# EAGLE design Logomatic (EAGLE 7.4.0)

## Sheet 1 of 2
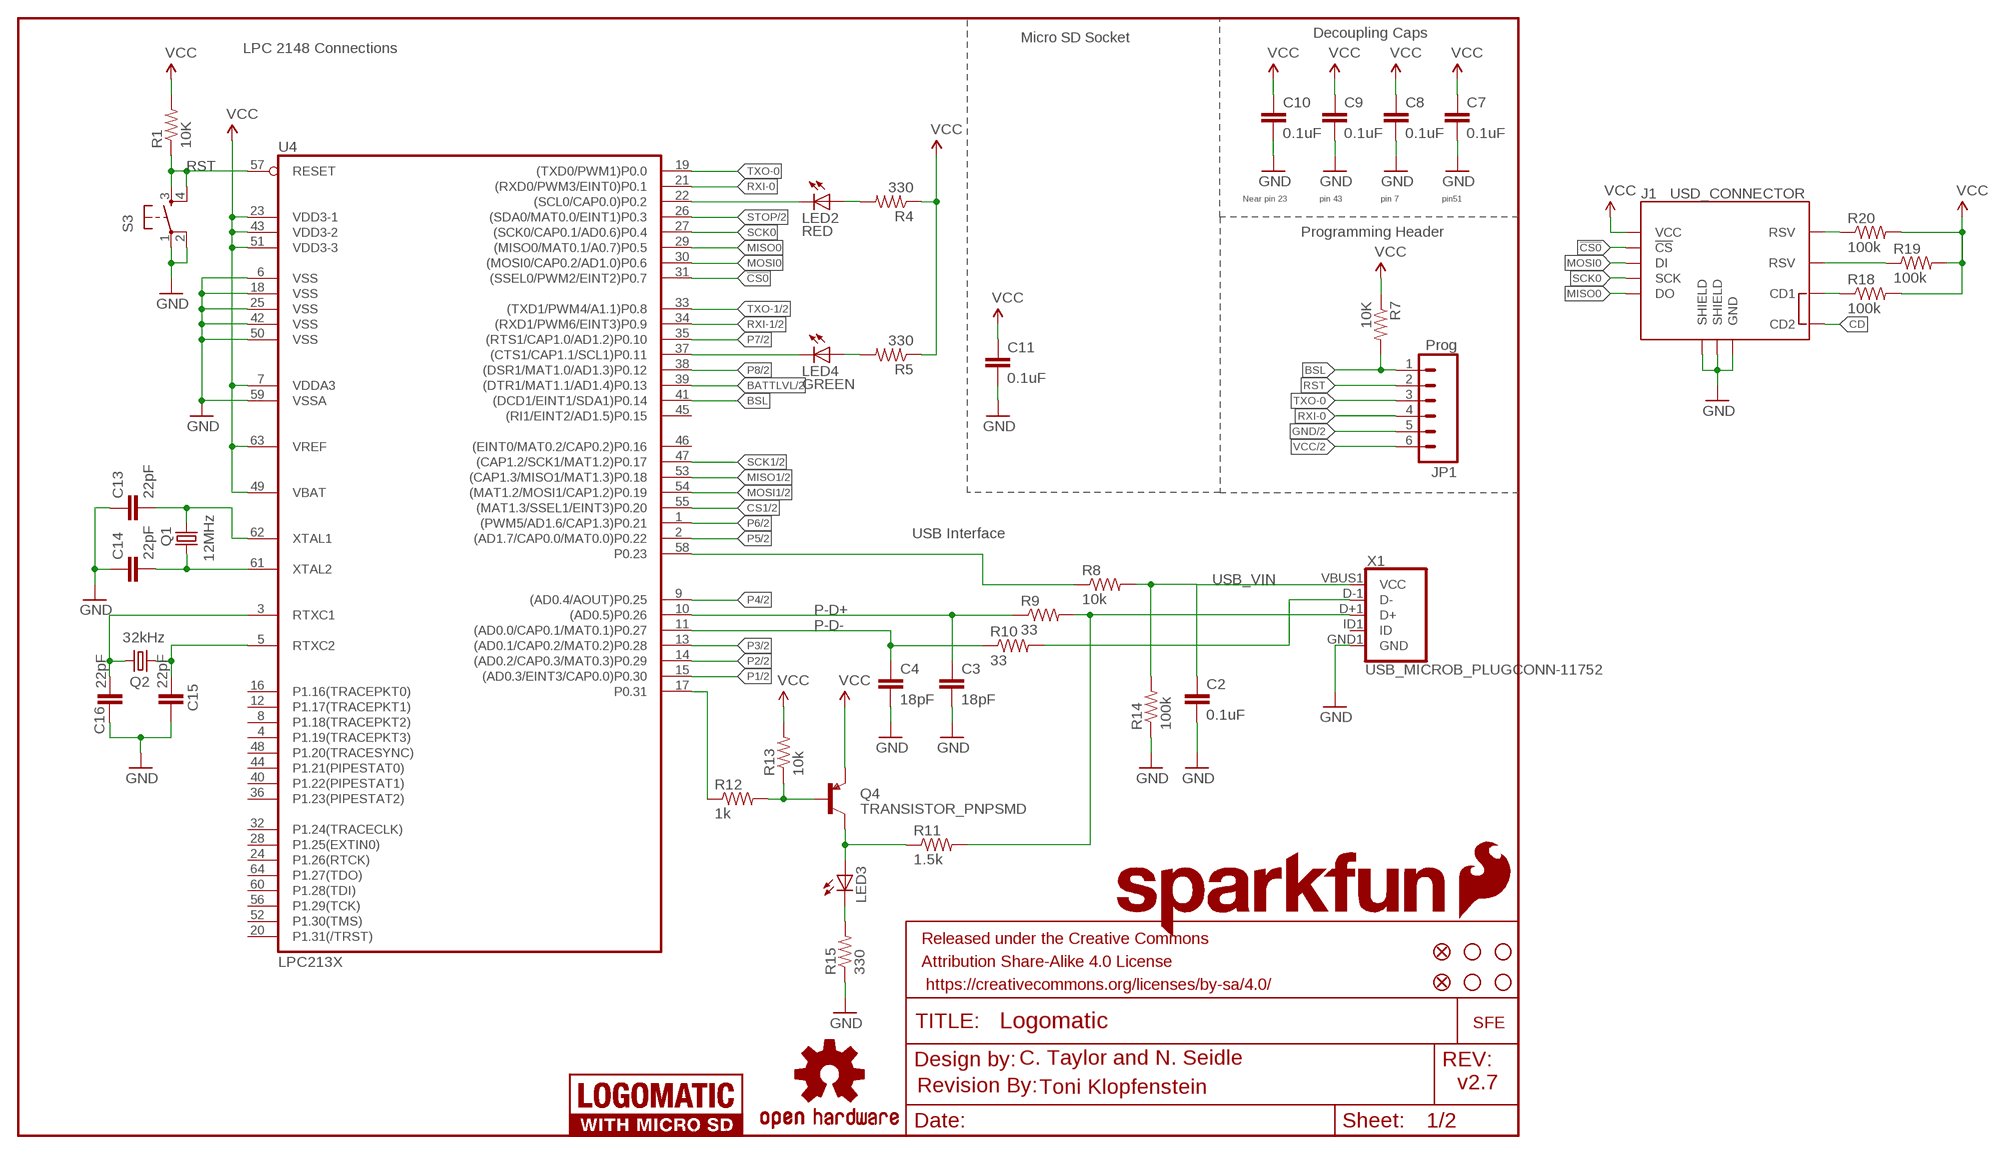
[diagram p0: schematic, sheet 1]

### Parts
C2  0.1uF  0.1UF-25V(+80/-20%)(0603)  [0603-CAP]
C3  18pF  18PF-50V-5%(0603)  [0603-CAP]
C4  18pF  18PF-50V-5%(0603)  [0603-CAP]
C7  0.1uF  0.1UF-25V(+80/-20%)(0603)  [0603-CAP]
C8  0.1uF  0.1UF-25V(+80/-20%)(0603)  [0603-CAP]
C9  0.1uF  0.1UF-25V(+80/-20%)(0603)  [0603-CAP]
C10  0.1uF  0.1UF-25V(+80/-20%)(0603)  [0603-CAP]
C11  0.1uF  0.1UF-25V(+80/-20%)(0603)  [0603-CAP]
C13  22pF  22PF-50V-5%(0603)  [0603-CAP]
C14  22pF  22PF-50V-5%(0603)  [0603-CAP]
C15  22pF  22PF-50V-5%(0603)  [0603-CAP]
C16  22pF  22PF-50V-5%(0603)  [0603-CAP]
FRAME2  FRAME-LETTER  [CREATIVE_COMMONS]
J1  USD_CONNECTOR  [MICRO-SD-SOCKET-PP]
JP1  Prog  M06SIP  [1X06]
LED2  RED  LED-RED0603  [LED-0603]
LED3  LED-RED0603  [LED-0603]
LED4  GREEN  LED-GREEN0603  [LED-0603]
LOGO1  OSHW-LOGOL  [OSHW-LOGO-L]
LOGO2  SFE_LOGO_NAME.1_INCH  [SFE_LOGO_NAME_.1]
LOGO3  SFE_LOGO_FLAME.4_INCH  [SFE_LOGO_FLAME_.4]
Q1  12MHz  CRYSTAL5X3  [CRYSTAL-SMD-5X3]
Q2  32kHz  CRYSTAL32-SMD  [CRYSTAL-32KHZ-SMD]
Q4  TRANSISTOR_PNPSMD  [SOT23-3]
R1  10K  10KOHM1/10W1%(0603)0603  [0603-RES@1]
R4  330  330OHM1/10W1%(0603)  [0603-RES]
R5  330  330OHM1/10W1%(0603)  [0603-RES]
R7  10K  10KOHM1/10W1%(0603)0603  [0603-RES@1]
R8  10k  10KOHM1/10W1%(0603)0603  [0603-RES@1]
R9  33  33OHM1/10W1%(0603)  [0603-RES]
R10  33  33OHM1/10W1%(0603)  [0603-RES]
R11  1.5k  1.5KOHM1/10W1%(0603)  [0603]
R12  1k  1KOHM1/10W1%(0603)  [0603-RES@1]
R13  10k  10KOHM1/10W1%(0603)0603  [0603-RES@1]
R14  100k  100KOHM1/10W1%(0603)  [0603-RES@1]
R15  330  330OHM1/10W1%(0603)  [0603-RES]
R18  100k  100KOHM-1/10W-1%(0603)  [0603-RES]
R19  100k  100KOHM-1/10W-1%(0603)  [0603-RES]
R20  100k  100KOHM-1/10W-1%(0603)  [0603-RES]
S3  Reset  TAC_SWITCHSND  [TACTILE_SWITCH_SMD]
U4  LPC213X  [SQFP-S-10X10-64]
U$1  FIDUCIAL1X2  [FIDUCIAL-1X2]
U$2  FIDUCIAL1X2  [FIDUCIAL-1X2]
U$3  STAND-OFF  [STAND-OFF]
U$4  STAND-OFF  [STAND-OFF]
U$5  STAND-OFF  [STAND-OFF]
U$6  LOGOMATIC_LOGO  [LOGOMATIC_LOGO]
U$7  LOGO-SFESK  [SFE-LOGO-FLAME]
U$8  STAND-OFF  [STAND-OFF]
U$10  REVISION  [REVISION]
X1  USB_MICROB_PLUGCONN-11752  [USB-B-MICRO-SMD_V03]

### Nets
!CS0: J1.CS(!CS) U4.31((SSEL0/PWM2/EINT2)P0.7)
BATTLVL: U4.39((DTR1/MAT1.1/AD1.4)P0.13) ; also sheet 2
BSL: JP1.1 R7.2 U4.41((DCD1/EINT1/SDA1)P0.14)
CD: J1.CD2
CS1: U4.55((MAT1.3/SSEL1/EINT3)P0.20) ; also sheet 2
GND [power]: C2.2 C3.2 C4.2 C7.2 C8.2 C9.2 C10.2 C11.2 C13.1 C14.1 C15.1 C16.1 J1.GND J1.GND1(SHIELD) J1.GND3(SHIELD) JP1.5 R14.1 R15.1 S3.1 S3.2 U4.6(VSS) U4.18(VSS) U4.25(VSS) U4.42(VSS) U4.50(VSS) U4.59(VSSA) X1.GND1(GND) ; also sheet 2
MISO0: J1.DO U4.29((MISO0/MAT0.1/A0.7)P0.5)
MISO1: U4.53((CAP1.3/MISO1/MAT1.3)P0.18) ; also sheet 2
MOSI0: J1.DI U4.30((MOSI0/CAP0.2/AD1.0)P0.6)
MOSI1: U4.54((MAT1.2/MOSI1/CAP1.2)P0.19) ; also sheet 2
N$3: J1.CD1 R18.1
N$4: J1.RSV1(RSV) R20.1
N$5: C13.2 Q1.3 U4.62(XTAL1)
N$6: C16.2 Q2.X2 U4.3(RTXC1)
N$7: LED2.A R4.2
N$9: C15.2 Q2.X1 U4.5(RTXC2)
N$10: J1.RSV2(RSV) R19.1
N$16: R8.1 U4.58(P0.23)
N$17: Q4.1(B) R12.2 R13.1
N$19: LED4.A R5.2
N$21: C14.2 Q1.1 U4.61(XTAL2)
N$31: R12.1 U4.17(P0.31)
N$33: LED3.C R15.2
P1: U4.15((AD0.3/EINT3/CAP0.0)P0.30) ; also sheet 2
P2: U4.14((AD0.2/CAP0.3/MAT0.3)P0.29) ; also sheet 2
P3: U4.13((AD0.1/CAP0.2/MAT0.2)P0.28) ; also sheet 2
P4: U4.9((AD0.4/AOUT)P0.25) ; also sheet 2
P5: U4.2((AD1.7/CAP0.0/MAT0.0)P0.22) ; also sheet 2
P6: U4.1((PWM5/AD1.6/CAP1.3)P0.21) ; also sheet 2
P7: U4.35((RTS1/CAP1.0/AD1.2)P0.10) ; also sheet 2
P8: U4.38((DSR1/MAT1.0/AD1.3)P0.12) ; also sheet 2
P-D+: C3.1 R9.1 U4.10((AD0.5)P0.26)
P-D-: C4.1 R10.1 U4.11((AD0.0/CAP0.1/MAT0.1)P0.27)
RST: JP1.2 R1.1 S3.3 S3.4 U4.57(RESET)
RXI-0: JP1.4 U4.21((RXD0/PWM3/EINT0)P0.1)
RXI-1: U4.34((RXD1/PWM6/EINT3)P0.9) ; also sheet 2
SCK0: J1.SCLK(SCK) U4.27((SCK0/CAP0.1/AD0.6)P0.4)
SCK1: U4.47((CAP1.2/SCK1/MAT1.2)P0.17) ; also sheet 2
STAT: LED3.A Q4.3(C) R11.1
STAT0: LED2.C U4.22((SCL0/CAP0.0)P0.2)
STAT1: LED4.C U4.37((CTS1/CAP1.1/SCL1)P0.11)
STOP: U4.26((SDA0/MAT0.0/EINT1)P0.3) ; also sheet 2
TXO-0: JP1.3 U4.19((TXD0/PWM1)P0.0)
TXO-1: U4.33((TXD1/PWM4/A1.1)P0.8) ; also sheet 2
USB_D+: R9.2 R11.2 X1.D+1(D+)
USB_D-: R10.2 X1.D-1(D-)
USB_VIN: C2.1 R8.2 R14.2 X1.VBUS1(VCC) ; also sheet 2
VCC: C7.1 C8.1 C9.1 C10.1 C11.1 J1.VCC JP1.6 Q4.2(E) R1.2 R4.1 R5.1 R7.1 R13.2 R18.2 R19.2 R20.2 U4.7(VDDA3) U4.23(VDD3-1) U4.43(VDD3-2) U4.49(VBAT) U4.51(VDD3-3) U4.63(VREF) ; also sheet 2
Unconnected: U4.4(P1.19(TRACEPKT3)) U4.8(P1.18(TRACEPKT2)) U4.12(P1.17(TRACEPKT1)) U4.16(P1.16(TRACEPKT0)) U4.20(P1.31(/TRST)) U4.24(P1.26(RTCK)) U4.28(P1.25(EXTIN0)) U4.32(P1.24(TRACECLK)) U4.36(P1.23(PIPESTAT2)) U4.40(P1.22(PIPESTAT1)) U4.44(P1.21(PIPESTAT0)) U4.45((RI1/EINT2/AD1.5)P0.15) U4.46((EINT0/MAT0.2/CAP0.2)P0.16) U4.48(P1.20(TRACESYNC)) U4.52(P1.30(TMS)) U4.56(P1.29(TCK)) U4.60(P1.28(TDI)) U4.64(P1.27(TDO)) X1.ID1(ID)

### Notes on the sheet
- Decoupling Caps
- Micro SD Socket
- LPC 2148 Connections
- Near pin 23 | pin 43 | pin 7 | pin51
- Programming Header
- USB Interface
- C. Taylor and N. Seidle
- Toni Klopfenstein | v2.7

## Sheet 2 of 2
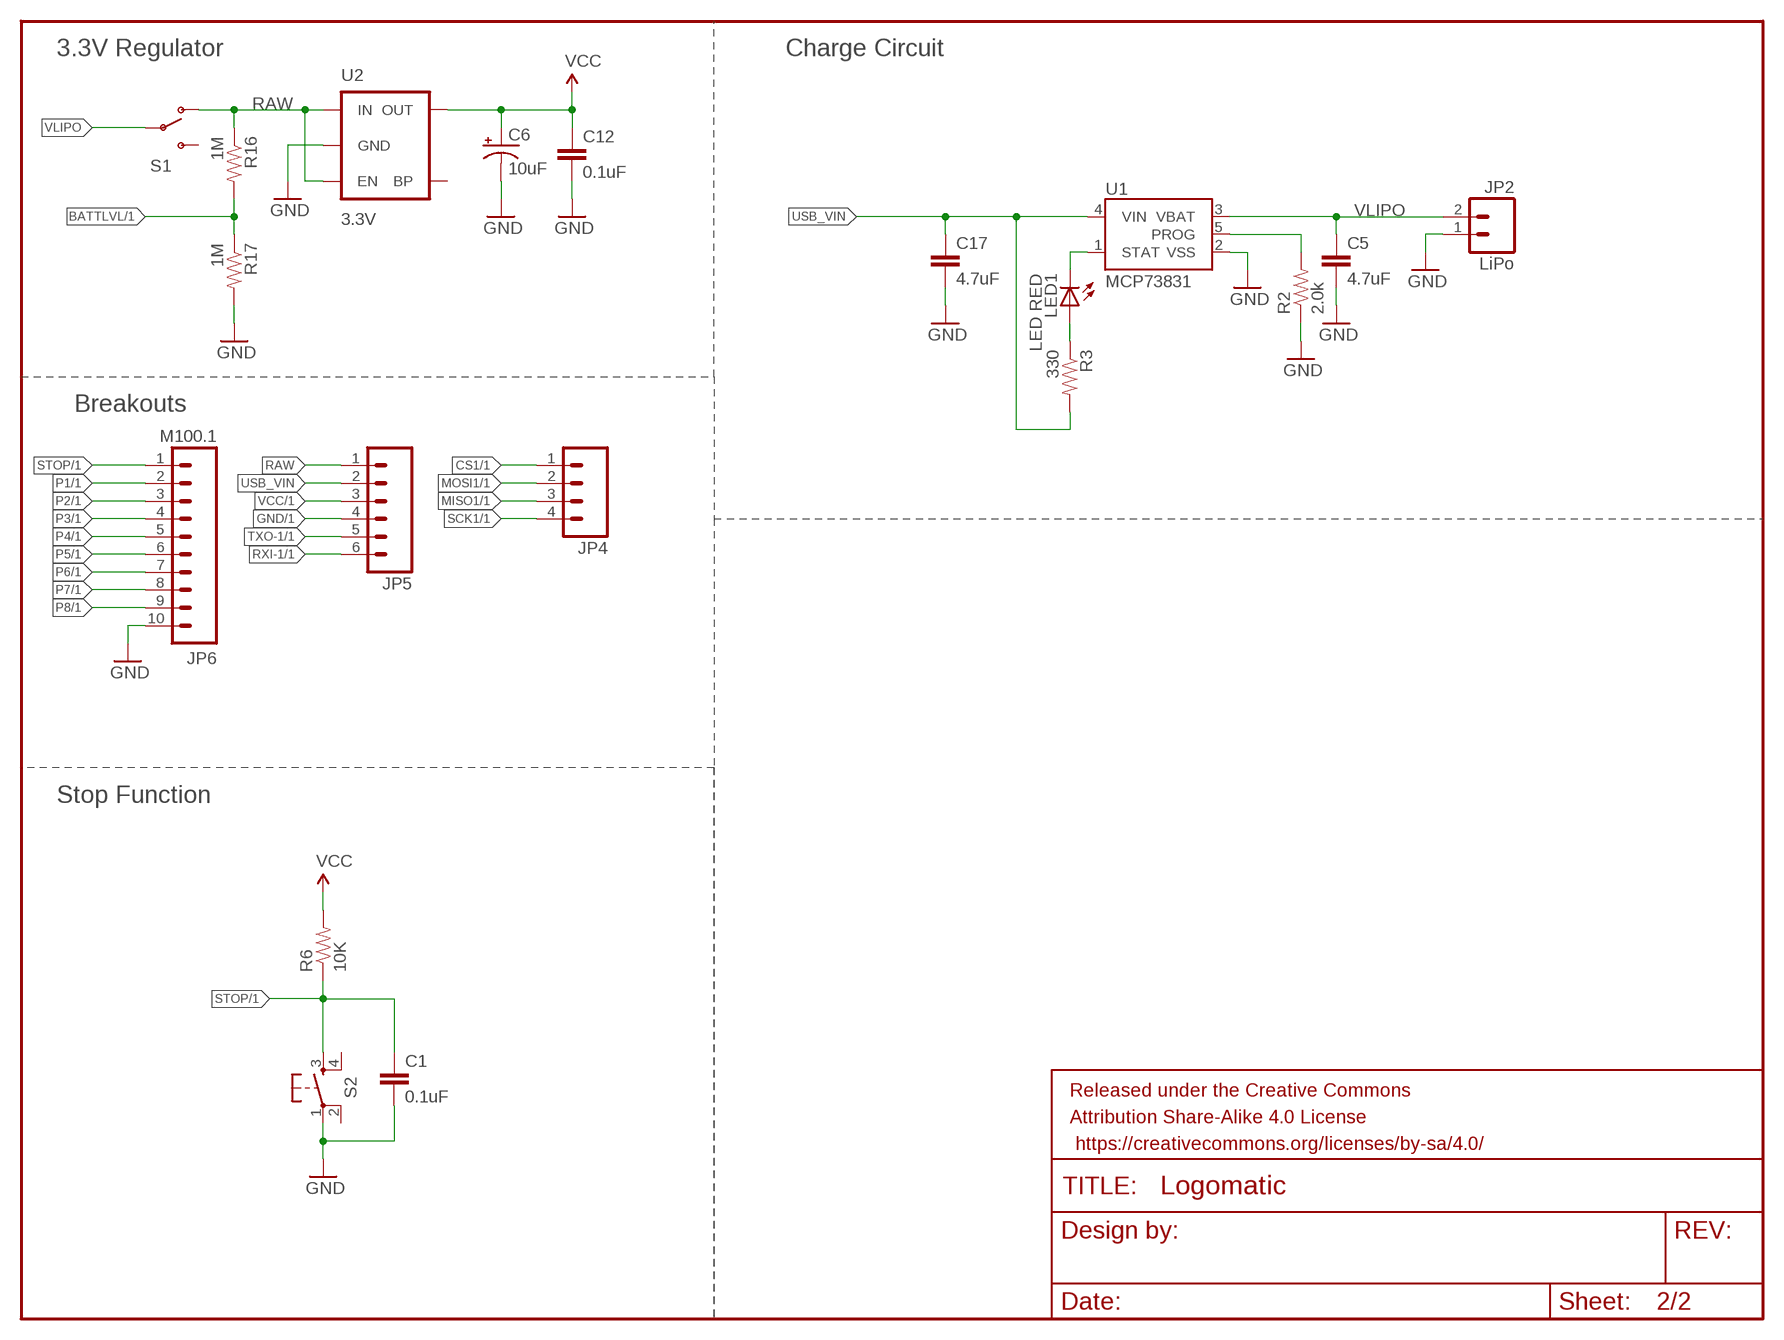
[diagram p1: schematic, sheet 2]

### Parts
C1  0.1uF  0.1UF-25V(+80/-20%)(0603)  [0603-CAP]
C5  4.7uF  4.7UF-6.3V-10%(0603)0603  [0603-CAP]
C6  10uF  10UF-16V-10%(TANT)  [EIA3216]
C12  0.1uF  0.1UF-25V(+80/-20%)(0603)  [0603-CAP]
C17  4.7uF  4.7UF-6.3V-10%(0603)0603  [0603-CAP]
FRAME4  FRAME-LETTER  [CREATIVE_COMMONS]
JP2  LiPo  M02-JST-2MM-SMT  [JST-2-SMD]
JP4  M04PTH  [1X04]
JP5  M06SIP  [1X06]
JP6  M100.1  M10"  [1X10]
LED1  LED RED  LED-RED0603  [LED-0603]
R2  2.0k  2.0KOHM1/10W5%(0603)  [0603-RES]
R3  330  330OHM1/10W1%(0603)  [0603-RES]
R6  10K  10KOHM1/10W1%(0603)0603  [0603-RES@1]
R16  1M  1MOHM1/10W1%(0603)  [0603-RES@1]
R17  1M  1MOHM1/10W1%(0603)  [0603-RES@1]
S1  SWITCH-SPSTSMD  [AYZ0202]
S2  Stop  TAC_SWITCHSND  [TACTILE_SWITCH_SMD]
U1  MCP73831  MCP73831SMD  [SOT23-5]
U2  3.3V  V_REG_LDOSMD  [SOT23-5]

### Nets
BATTLVL: R16.2 R17.1 ; also sheet 1
CS1: JP4.1 ; also sheet 1
GND [power]: C1.2 C5.2 C6.C(-) C12.2 C17.2 JP2.1 JP5.4 JP6.10 R2.1 R17.2 S2.1 U1.2(VSS) U2.2(GND) ; also sheet 1
MISO1: JP4.3 ; also sheet 1
MOSI1: JP4.2 ; also sheet 1
N$1: R2.2 U1.5(PROG)
N$12: LED1.C U1.1(STAT)
N$13: LED1.A R3.1
P1: JP6.2 ; also sheet 1
P2: JP6.3 ; also sheet 1
P3: JP6.4 ; also sheet 1
P4: JP6.5 ; also sheet 1
P5: JP6.6 ; also sheet 1
P6: JP6.7 ; also sheet 1
P7: JP6.8 ; also sheet 1
P8: JP6.9 ; also sheet 1
RAW: JP5.1 R16.1 S1.1(O) U2.1(IN) U2.3(EN)
RXI-1: JP5.6 ; also sheet 1
SCK1: JP4.4 ; also sheet 1
STOP: C1.1 JP6.1 R6.1 S2.3 ; also sheet 1
TXO-1: JP5.5 ; also sheet 1
USB_VIN: C17.1 JP5.2 R3.2 U1.4(VIN) ; also sheet 1
VCC: C6.A(+) C12.1 JP5.3 R6.2 U2.5(OUT) ; also sheet 1
VLIPO [power]: C5.1 JP2.2 S1.2(P) U1.3(VBAT)
Unconnected: S1.3(S) S2.2 S2.4 U2.4(BP)

### Notes on the sheet
- 3.3V Regulator | Charge Circuit
- Breakouts
- Stop Function

## Library data of the parts
C1 C2 C7-C12 = SparkFun-Capacitors:0.1UF-25V(+80/-20%)(0603): CAP-00810 Ceramic Standard decoupling cap; PROD_ID: CAP-00810
C3 C4 = SparkFun-Capacitors:18PF-50V-5%(0603): CAP-08267; PROD_ID: CAP-08267
C5 C17 = SparkFun-Capacitors:4.7UF-6.3V-10%(0603): CAP-08280; PROD_ID: CAP-08280
C6 = SparkFun-Capacitors:10UF-16V-10%(TANT): CAP-00811 1206/EIA-3216 Tantalum capacitor; PROD_ID: CAP-00811
C13-C16 = SparkFun-Capacitors:22PF-50V-5%(0603): CAP-07876; PROD_ID: CAP-07876
FRAME2 FRAME4 = SparkFun-Aesthetics:FRAME-LETTER: Schematic Frame Standard 8.5x11 US Letter frame
J1 = SparkFun-Connectors:USD_CONNECTOR: microSD Socket Push-push type µSD socket. Footprint production proven. Symbol has new and improved layout and naming accuracy. SparkFun Electronics SKU : PRT-00127. tDoc lines correctly indicate media card edge positions when inserting (unlocked, locked, depressed). NOTE: CD1 and CD2 are connected internally; PROD_ID: CONN-07820
JP1 JP5 = SparkFun:M06: Header 6 Standard 6-pin 0.1" header. Use with straight break away headers (SKU : PRT-00116), right angle break away headers (PRT-00553), swiss pins (PRT-00743), machine pins (PRT-00117), and female headers (PRT-00115). Molex polarized connector foot print use with SKU : PRT-08094 with associated crimp pins and housings. NOTES ON THE VARIANTS LOCK and LOCK_LONGPADS... This footprint was designed to help hold the alignment of a through-hole component (i.e. 6-pin header) while soldering it into place. You may notice that each hole has been shifted either up or down by 0.005 of an inch from it's more standard position (which is a perfectly straight line). This slight alteration caused the pins (the squares in the middle) to touch the edges of the holes. Because they are alternating, it causes a "brace" to hold the component in place. 0.005 has proven to be the perfect amount of "off-center" position when using our standard breakaway headers. Although looks a little odd when you look at the bare footprint, once you have a header in there, the alteration is very hard to notice. Also, if you push a header all the way into place, it is covered up entirely on the bottom side. This idea of altering the position of holes to aid alignment will be further integrated into the Sparkfun Library for other footprints. It can help hold any component with 3 or more connection pins.
JP2 = SparkFun:M02: Header 2 Standard 2-pin 0.1" header. Use with straight break away headers (SKU : PRT-00116), right angle break away headers (PRT-00553), swiss pins (PRT-00743), machine pins (PRT-00117), and female headers (PRT-00115). Molex polarized connector foot print use with SKU : PRT-08233 with associated crimp pins and housings.
JP4 = SparkFun:M04: Header 4 Standard 4-pin 0.1" header. Use with straight break away headers (SKU : PRT-00116), right angle break away headers (PRT-00553), swiss pins (PRT-00743), machine pins (PRT-00117), and female headers (PRT-00115). Molex polarized connector foot print use with SKU : PRT-08231 with associated crimp pins and housings.
JP6 = SparkFun:M10: Header 10 Standard 10-pin 0.1" header. Use with straight break away headers (SKU : PRT-00116), right angle break away headers (PRT-00553), swiss pins (PRT-00743), machine pins (PRT-00117), and female headers (PRT-00115).
LED1 LED3 = SparkFun-LED:LED-RED: Assorted Red LEDs LilyPad 1206- DIO-09912 1206- DIO-00809 0603- DIO-00819; PROD_ID: DIO-00819; VALUE: RED
LED2 = SparkFun-LED:LED-RED: Assorted Red LEDs LilyPad 1206- DIO-09912 1206- DIO-00809 0603- DIO-00819; PROD_ID: DIO-00819
LED4 = SparkFun-LED:LED-GREEN: Various green LEDs Green LEDs used in SFE Production 0603- DIO-00821 LARGE- DIO-00862 LILYPAD- DIO-09910; PROD_ID: DIO-00821
LOGO1 = SparkFun-Aesthetics:OSHW-LOGO: Open Source Hardware Logo This logo indicates the piece of hardware it is found on incorporates a OSHW license and/or adheres to the definition of open source hardware found here: http://freedomdefined.org/OSHW
LOGO2 = SparkFun-Aesthetics:SFE_LOGO_NAME: SFE Logo, name only This is the SparkFun name logo. The logo on the schematic will always be the same size; the package variant is the height of the flame part of the logo (or the height the flame would be, if it were drawn). Default layer for the logo on the board is tSilk.
LOGO3 = SparkFun-Aesthetics:SFE_LOGO_FLAME: SFE Logo, flame only This is the SparkFun flame logo. The logo on the schematic will always be the same size; the package variant is the height of the flame. Default layer for the logo on the board is tSilk.
Q1 = SparkFunEagle-6-6-07:CRYSTAL: Crystals Various standard crystals. Proven footprints. Spark Fun Electronics SKU : COM-00534
Q2 = SparkFun:CRYSTAL: Crystals Various standard crystals. Proven footprints. Spark Fun Electronics SKU : COM-00534
Q4 = SparkFun:TRANSISTOR_PNP
R1 R6 R7 = SparkFun-Resistors:10KOHM1/10W1%(0603): RES-00824; PROD_ID: RES-00824
R2 = SparkFun-Resistors:2.0KOHM1/10W5%(0603): RES-08296; PROD_ID: RES-08296
R3-R5 R15 = SparkFun-Resistors:330OHM1/10W1%(0603): RES-00818; PROD_ID: RES-00818
R8 R13 = SparkFun-Resistors:10KOHM1/10W1%(0603): RES-00824; PROD_ID: RES-00824; VALUE: 10K
R9 R10 = SparkFun-Resistors:33OHM1/10W1%(0603): RES-08270; PROD_ID: RES-08270
R11 = SparkFun-Resistors:1.5KOHM1/10W1%(0603): RES-08306; PROD_ID: RES-08306; VALUE: 1.5KOHM
R12 = SparkFun-Resistors:1KOHM1/10W1%(0603): RES-07856; PROD_ID: RES-07856; VALUE: 1K
R14 = SparkFun-Resistors:100KOHM1/10W1%(0603): RES-07828; PROD_ID: RES-07828
R16 R17 = SparkFun-Resistors:1MOHM1/10W1%(0603): RES-07868; PROD_ID: RES-07868
R18-R20 = SparkFun-Resistors:100KOHM-1/10W-1%(0603): RES-07828; PROD_ID: RES-07828
S1 = SparkFun:SWITCH-SPST: SPST Switch Simple slide switch. Spark Fun Electronics SKU : COM-00102
S2 S3 = SparkFunEagle-6-6-07:TAC_SWITCH: Momentary Switch Button commonly used for reset or general input. Spark Fun Electronics SKU : COM-00097
U1 = SparkFun:MCP73831
U2 = SparkFun:V_REG_LDO: Voltage Regulator LDO Standard 150mA LDO voltage regulator in SOT-23 layout. Micrel part MIC5205. BP (by-pass) pin is used to lower output noise with 470pF cap.
U4 = SparkFun:LPC213X: LPC213x Schematic element and footprint for NXP LPC213x. Spark Fun Electronics SKU : COM-00520
U$1 U$2 = SparkFun:FIDUCIAL: Fiducial Alignment Points Various fiducial points for machine vision alignment.
U$3-U$5 U$8 = SparkFun:STAND-OFF: Stand Off This is the mechanical footprint for a #4 phillips button head screw. Use the keepout ring to avoid running the screw head into surrounding components. SKU : PRT-00447
U$6 = SparkFun-Aesthetics:LOGOMATIC_LOGO: Logo for the Logomatic boards. Silk is .4" by 1.1" Board logo is .4" by 1.1"
U$7 = SparkFun:LOGO-SFE: Spark Fun Electronics PCB Logo This is the standard Spark Fun Electronics PCB logo.
U$10 = SparkFun-Aesthetics:REVISION
X1 = SparkFun-Connectors:USB_MICROB_PLUG: USB Micro-B Plug Comes in a variety of packages. Check out Hirose's ZX-x0 line: http://www.hirose.co.jp/cataloge_hp/e24200011.pdf; PROD_ID: CONN-11752

## Net classes
0 default: width 0.178 mm
1 power: width 0.203 mm
2 hv: width 0.254 mm, clearance 0.229 mm

## Board
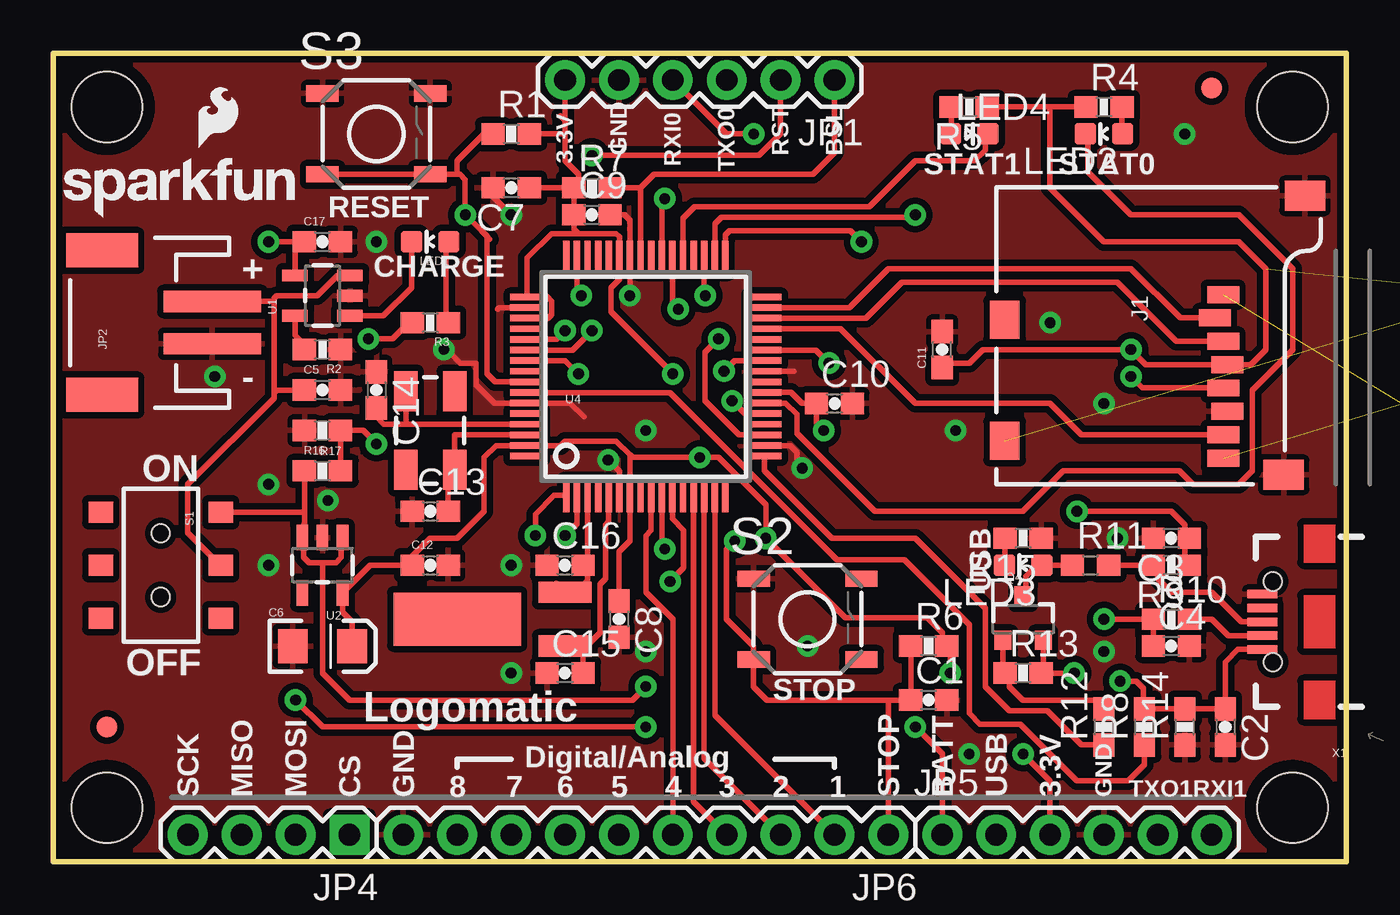
[diagram p2: board, top side]
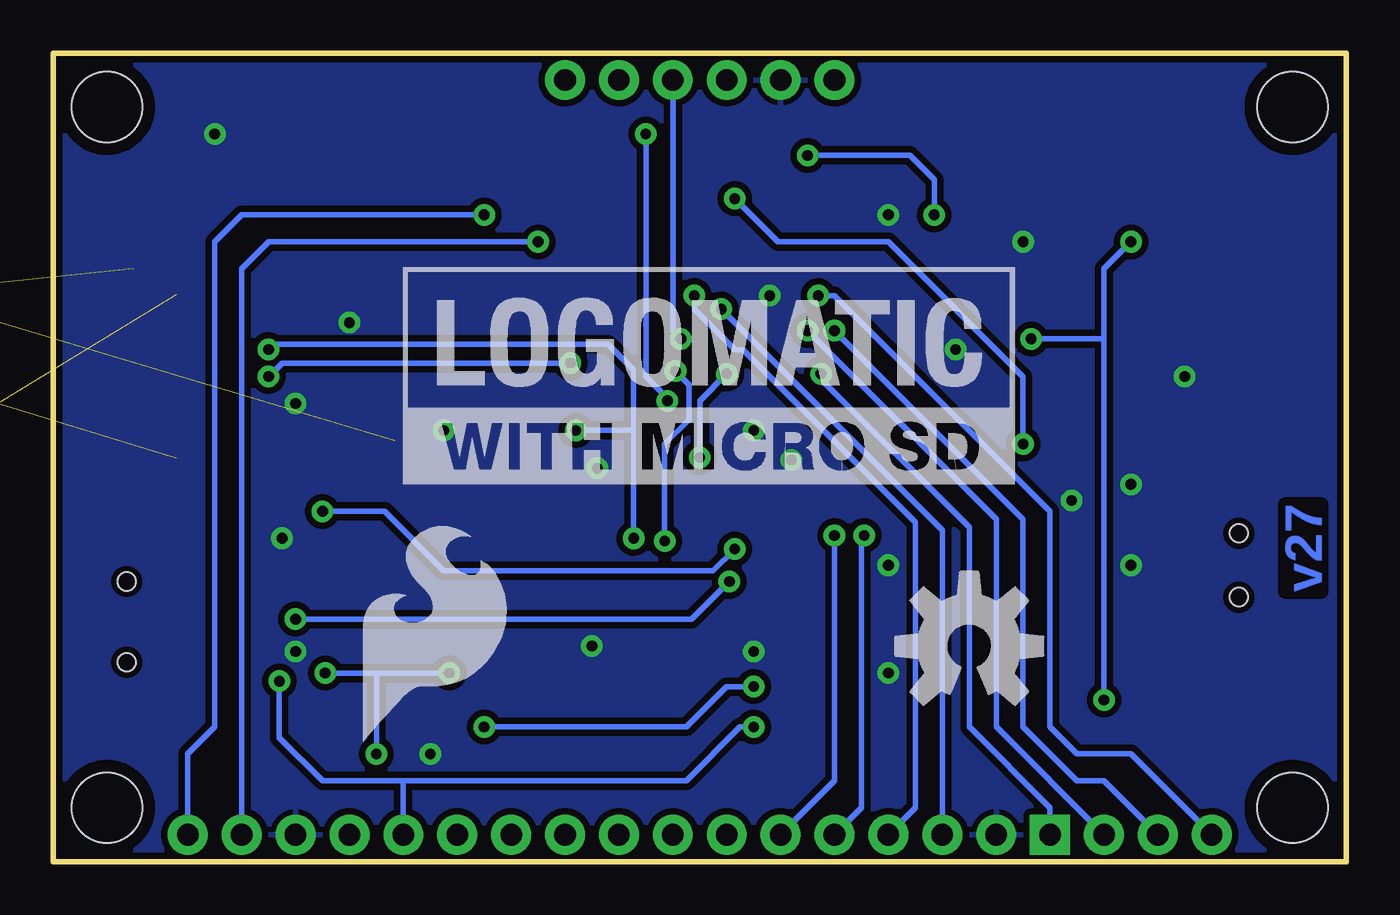
[diagram p3: board, bottom side, seen from below]

Size 60.96 x 38.1 mm. Coordinates in mm from the lower left corner, seen from the top.
Outline: 0,0 60.96,0 60.96,38.1 0,38.1 0,0
Copper layers (1*16): Top 0.035mm / dielectric 1.5mm / Bottom 0.035mm
Design rules "SparkFun-2-layer-STANDARD": minimum track width 10mil, minimum drill 20mil, track to track 10mil, track to pad 8mil, pad to pad 8mil, via to via 10mil, smd to smd 8mil, copper to edge 8mil, drill to drill 8mil, minimum pad ring 10mil, minimum via ring 10mil, stop-mask expansion 4mil, vias tented up to drill 20mil, thermal gap 10mil

### Footprints (pad centres in the part's own frame; a part is rotated, then mirrored left to right if it is on the bottom)
0603-CAP = smd 1.1 x 1: 1 -0.85,0; 2 0.85,0
EIA3216 = smd 1.4 x 1.6: A 1.4,0; C -1.4,0
MICRO-SD-SOCKET-PP = smd 1.8 x 1.4: CD1 -2.05,0.4; CD2 -7.75,0.4 | smd 0.8 x 1.5: CS -7.84,10.3; DI -6.74,10.7; DO -2.34,10.7; GND -3.44,10.9; RSV1 -8.94,10.7; RSV2 -1.24,10.7; SCLK -4.54,10.7; VCC -5.64,10.9 | smd 1.4 x 1.9: GND1 -13.6,14.55; GND3 -0.45,13.55
1X06 = drill 1.016 pad 1.88: 1 0,0; 2 2.54,0; 3 5.08,0; 4 7.62,0; 5 10.16,0; 6 12.7,0
JST-2-SMD = smd 1 x 4.6: 1 -1,-3.7; 2 1,-3.7 | smd 1.6 x 3.4: NC1 -3.4,1.5; NC2 3.4,1.5
1X04 = drill 1.016 pad 1.88 square: 1 0,0 | drill 1.016 pad 1.88: 2 2.54,0; 3 5.08,0; 4 7.62,0
1X10 = drill 1.016 pad 1.88: 1 0,0; 2 2.54,0; 3 5.08,0; 4 7.62,0; 5 10.16,0; 6 12.7,0; 7 15.24,0; 8 17.78,0; 9 20.32,0; 10 22.86,0
LED-0603 = smd 1 x 1: A 0,-0.877; C 0,0.877
CRYSTAL-SMD-5X3 = smd 1.9 x 1.1: 1 -1.85,-1.15; 2 1.85,-1.15; 3 1.85,1.15; 4 -1.85,1.15
CRYSTAL-32KHZ-SMD = smd 2.5 x 6: SHEILD 0,5.08 | smd 1 x 2.5: X1 -1.27,0; X2 1.27,0
SOT23-3 = smd 0.8 x 0.9: 1 -0.95,-1; 2 0.95,-1; 3 0,1.1
0603-RES@1 = smd 1.1 x 1: 1 -0.85,0; 2 0.85,0
0603-RES = smd 1.1 x 1: 1 -0.85,0; 2 0.85,0
0603 = smd 1.1 x 1: 1 -0.85,0; 2 0.85,0
AYZ0202 = smd 1 x 1.15: 1 -2.5,2.825; 2 0,2.825; 3 2.5,2.825; 4 -2.5,-2.825; 5 0,-2.825; 6 2.5,-2.825 | hole 0.85: 1.5,0; -1.5,0
TACTILE_SWITCH_SMD = smd 1.524 x 0.762: 1 -2.54,1.905; 2 2.54,1.905; 3 -2.54,-1.905; 4 2.54,-1.905
SOT23-5 = smd 0.55 x 1.2: 1 -0.95,-1.3; 2 0,-1.3; 3 0.95,-1.3; 4 0.95,1.3; 5 -0.95,1.3
SQFP-S-10X10-64 = smd 0.3 x 1.6: 1 -3.75,-5.6; 2 -3.25,-5.6; 3 -2.75,-5.6; 4 -2.25,-5.6; 5 -1.75,-5.6; 6 -1.25,-5.6; 7 -0.75,-5.6; 8 -0.25,-5.6; 9 0.25,-5.6; 10 0.75,-5.6; 11 1.25,-5.6; 12 1.75,-5.6; 13 2.25,-5.6; 14 2.75,-5.6; 15 3.25,-5.6; 16 3.75,-5.6; 33 3.75,5.6; 34 3.25,5.6; 35 2.75,5.6; 36 2.25,5.6; 37 1.75,5.6; 38 1.25,5.6; 39 0.75,5.6; 40 0.25,5.6; 41 -0.25,5.6; 42 -0.75,5.6; 43 -1.25,5.6; 44 -1.75,5.6; 45 -2.25,5.6; 46 -2.75,5.6; 47 -3.25,5.6; 48 -3.75,5.6 | smd 1.6 x 0.3: 17 5.6,-3.75; 18 5.6,-3.25; 19 5.6,-2.75; 20 5.6,-2.25; 21 5.6,-1.75; 22 5.6,-1.25; 23 5.6,-0.75; 24 5.6,-0.25; 25 5.6,0.25; 26 5.6,0.75; 27 5.6,1.25; 28 5.6,1.75; 29 5.6,2.25; 30 5.6,2.75; 31 5.6,3.25; 32 5.6,3.75; 49 -5.6,3.75; 50 -5.6,3.25; 51 -5.6,2.75; 52 -5.6,2.25; 53 -5.6,1.75; 54 -5.6,1.25; 55 -5.6,0.75; 56 -5.6,0.25; 57 -5.6,-0.25; 58 -5.6,-0.75; 59 -5.6,-1.25; 60 -5.6,-1.75; 61 -5.6,-2.25; 62 -5.6,-2.75; 63 -5.6,-3.25; 64 -5.6,-3.75
FIDUCIAL-1X2 = smd 1 x 1: 1 0,0
STAND-OFF = hole 3.302: 0,0
USB-B-MICRO-SMD_V03 = smd 1.4 x 0.4: D+1 2.7,0; D-1 2.7,0.65; GND1 2.7,-1.3; ID1 2.7,-0.65; VBUS1 2.7,1.3 | hole 0.85: 2.2,1.9; 2.2,-1.9

### Placement (x,y rotation side)
C1  41.27,7.62 0 top
C2  55.24,6.35 270 top
C3  52.7,15.24 180 top
C4  52.7,10.16 0 top
C5  12.7,22.23 0 top
C6  12.7,10.16 0 top
C7  21.59,31.75 180 top
C8  26.67,11.43 270 top
C9  25.4,30.48 0 top
C10  36.83,21.59 0 top
C11  41.91,24.13 90 top
C12  17.78,13.97 0 top
C13  17.78,16.51 0 top
C14  15.24,22.23 270 top
C15  24.13,8.89 0 top
C16  24.13,13.97 0 top
C17  12.7,29.21 0 top
FRAME2  9.16,-10.16 0 top  (outside the outline)
FRAME4  9.18,-10.16 0 top  (outside the outline)
J1  44.45,17.78 270 top
JP1  36.83,36.83 180 top
JP2  3.81,25.4 90 top
JP4  13.97,1.27 180 top
JP5  41.91,1.27 0 top
JP6  39.37,1.27 180 top
LED1  17.78,29.21 90 top
LED2  49.53,34.29 90 top
LED3  45.72,13.97 90 top
LED4  43.18,34.29 270 top
LOGO1  17.78,10.16 0 bottom
LOGO2  0,29.84 0 top
LOGO3  46.99,5.08 0 bottom
Q1  17.78,20.32 270 top
Q2  24.13,11.43 90 top
Q4  45.72,11.43 0 top
R1  21.59,34.29 0 top
R2  12.7,24.13 180 top
R3  17.78,25.4 180 top
R4  49.53,35.56 0 top
R5  43.18,35.56 180 top
R6  41.27,10.16 0 top
R7  25.4,31.75 0 top
R8  51.44,6.35 90 top
R9  52.7,13.97 180 top
R10  52.7,11.43 0 top
R11  48.9,13.97 0 top
R12  49.53,6.35 90 top
R13  45.72,8.89 0 top
R14  53.34,6.35 90 top
R15  45.72,15.24 180 top
R16  12.7,18.41 0 top
R17  12.7,20.32 180 top
R18  68.58,26.67 0 top  (outside the outline)
R19  68.58,22.86 0 top  (outside the outline)
R20  68.58,19.05 0 top  (outside the outline)
S1  5.08,13.97 270 top
S2  35.56,11.43 0 top
S3  15.24,34.29 0 top
U1  12.7,26.67 90 top
U2  12.7,13.97 180 top
U4  27.94,22.86 0 top
U$1  2.54,6.35 0 top
U$2  54.61,36.45 0 top
U$3  2.54,2.54 0 top
U$4  58.42,2.54 0 top
U$5  2.54,35.56 0 top
U$6  44.45,17.78 0 bottom
U$7  6.86,33.66 0 top
U$8  58.42,35.56 0 top
U$10  20.83,-12.83 0 top  (outside the outline)
X1  59.69,11.3 180 top

### Tracks (layer width: path | path; a pad name or v marks a point on that pad's centre or on a via)
!CS0
  Top 0.254: U4.31 37.54,26.11 39.37,27.94 50.8,27.94 53.12,25.62 J1.CS
BATTLVL  (via drill 0.51)
  Top 0.254: U4.39 28.69,31.1 v28.83,31.24 | R16.2 R17.1 14.61,20.32 v15.24,19.68
  Bottom 0.254: v28.83,31.24 26.8,29.21 21.59,29.21 15.24,22.86 v15.24,19.68
BSL
  Top 0.254: U4.41 27.69,28.45 27.69,31.75 | JP1.1 36.83,33.4 35.81,32.38 28.32,32.38 27.69,31.75 | 27.69,31.75 R7.2
CS1  (via drill 0.51)
  Top 0.254: U4.55 24.14,23.61 v24.77,22.99
  Bottom 0.254: JP4.1 13.97,2.54 17.78,6.35 17.78,15.75 24.77,22.73 v24.77,22.99
GND  (via drill 0.51)
  Top 0.254: U4.25 34.92,23.11 | v27.18,26.67 27.19,26.68 U4.42 27.19,30.21 26.92,30.48 C9.2 26.04,30.48 | U4.6 26.69,18.39 26.42,18.67 | U4.18 34.75,19.61 35.05,19.3 35.05,18.8 v35.31,18.54 | 25.02,20.95 24.36,21.61 U4.59 20.81,21.61 19.94,22.48 19.94,23.5 19.18,23.5 18.8,23.88 | C7.2 20.74,31.33 v21.59,30.48 | U4.50 21.03,26.11 20.95,26.04
  other vias: 27.94,9.91 53.34,34.29 18.41,24.13 49.53,9.91 35.56,10.16 27.94,20.32 10.16,13.97 26.16,18.92 42.55,20.32 21.59,13.97 7.62,22.86 43.18,5.08 50.16,15.24 10.16,17.78 46.99,25.4 49.53,21.59 15.24,29.21 12.95,17.02 21.59,8.89
  pour Top (isolate 0.305): 0,0 60.96,0 60.96,38.1 0,38.1
  pour Bottom (isolate 0.305): 0,0 60.96,0 60.96,38.1 0,38.1
MISO0
  Top 0.254: U4.29 37.12,25.11 40.64,21.59 46.99,21.59 48.46,20.12 J1.DO
MISO1  (via drill 0.51)
  Top 0.254: U4.53 23.72,24.61 v24.13,25.02
  Bottom 0.254: JP4.3 11.43,3.81 12.7,3.81 15.24,6.35 15.24,16.13 v24.13,25.02
MOSI0
  Top 0.254: U4.30 38.31,25.61 40.01,27.3 50.16,27.3 52.95,24.52 J1.DI
MOSI1  (via drill 0.51)
  Top 0.254: U4.54 24.49,24.11 v25.4,25.02
  Bottom 0.254: JP4.2 16.51,6.35 16.51,16.13 v25.4,25.02
N$1
  Top 0.254: U1.5 11.4,24.8 12.05,24.14 11.87,24.14 R2.2
N$3  (1 unrouted)
N$4  (1 unrouted)
N$5
  Top 0.254: U4.62 18.92,20.11 18.92,20.07 18.93,20.06 Q1.3 18.63,18.17 C13.2
N$6
  Top 0.254: 25.19,13.76 U4.3 | 23.71,13.12 Q2.X2 24.64,12.7 25.19,13.25 25.19,13.76 | 25.19,13.76 C16.2
N$7
  Top 0.254: R4.2 50.38,34.32 LED2.A
N$9
  Top 0.254: U4.5 26.19,16.03 26.04,15.88 26.04,13.34 25.78,13.08 25.78,10.79 25.15,10.16 24.77,10.16 | 24.77,10.16 24.77,10.03 24.98,9.82 C15.2 | 24.77,10.16 Q2.X1
N$10  (1 unrouted)
N$12
  Top 0.254: U1.1 15.56,25.72 16.89,27.05 16.89,29.2 LED1.C
N$13
  Top 0.254: R3.1 18.53,25.5 18.53,29.08 LED1.A
N$16
  Top 0.254: U4.58 22.35,22.1 29.08,22.1 36.96,14.22 40.13,14.22 43.18,11.18 43.18,6.99 43.69,6.48 45.59,6.48 48.26,3.81 50.67,3.81 51.44,4.57 R8.1
N$17
  Top 0.254: 49.49,7.24 R12.2 49.11,7.62 45.72,7.62 45.09,8.26 45.09,8.89 R13.1 44.77,8.99 Q4.1
N$19
  Top 0.254: R5.2 42.33,34.32 LED4.A
N$21
  Top 0.254: C14.2 15.24,20.95 15.59,20.61 16.64,20.61 | 16.64,20.61 U4.61 | 16.64,20.61 16.64,20.7 16.63,20.71 Q1.1
N$31
  Top 0.254: U4.17 33.54,19.06 33.53,19.05 33.53,18.41 36.7,15.24 40.64,15.24 43.94,11.94 43.94,8.26 45.09,7.11 46.86,7.11 48.48,5.5 R12.1
N$33
  Top 0.254: R15.2 44.87,14 LED3.C
P1
  Top 0.254: U4.15 31.19,6.91 JP6.2
P2
  Top 0.254: 30.69,17.36 U4.14 30.69,4.87 JP6.3
P3
  Top 0.254: U4.13 30.19,2.83 JP6.4
P4
  Top 0.254: U4.9 28.19,15.62 27.94,15.37 27.94,12.7 29.21,11.43 JP6.5
P5  (via drill 0.51)
  Top 0.254: U4.2 24.69,15.93 v24.13,15.37
  Bottom 0.254: v24.13,15.37 24.13,3.81 JP6.6
P6  (via drill 0.51)
  Top 0.254: 24.18,17.27 U4.1 23.61,17.26 22.73,16.38 v22.73,15.37
  Bottom 0.254: v22.73,15.37 22.86,15.24 22.86,2.54 JP6.7
P7  (via drill 0.51)
  Top 0.254: 30.69,28.49 U4.35 30.69,26.71 v30.73,26.67
  Bottom 0.254: v30.73,26.67 30.73,26.04 28.83,24.13 28.45,24.13 20.32,16 20.32,2.54 JP6.8
P8  (via drill 0.51)
  Top 0.254: U4.38 29.19,26.31 v29.46,26.04
  Bottom 0.254: JP6.9 19.05,15.62 v29.46,26.04
P-D+  (via drill 0.51)
  Top 0.254: U4.10 28.69,14.87 v28.83,14.73 | v48.26,16.51 52.7,16.51 53.34,15.88 53.34,15.46 C3.1 53.34,15.03 53.34,13.97 R9.1
  Bottom 0.254: v48.26,16.51 45.34,16.51 42.55,13.72 29.84,13.72 v28.83,14.73
P-D-  (via drill 0.51)
  Top 0.254: U4.11 29.19,16.15 29.72,15.62 29.72,13.84 v29.08,13.21 | v49.53,11.43 R10.1 C4.1
  Bottom 0.254: v49.53,11.43 30.86,11.43 v29.08,13.21
RAW  (via drill 0.51)
  Top 0.254: 11.75,15.55 U2.3 | 12.7,14.1 12.7,8.89 13.97,7.62 27.3,7.62 v27.94,8.26 | JP5.1 41.91,5.08 v40.64,6.35 | S1.1 11.81,16.47 11.85,16.51 | U2.3 11.81,15.33 11.81,15.88 11.85,15.91 11.85,16.51 | R16.1 11.85,16.51 | 12.7,14.1 12.06,14.1 11.81,14.35 11.81,15.21 U2.3 | 12.7,14.1 13.34,14.1 13.59,14.35 13.59,15.21 | 13.59,15.21 U2.1 | 13.59,15.21 13.59,15.49 13.65,15.55
  Bottom 0.254: v40.64,6.35 31.11,6.35 29.21,8.26 v27.94,8.26
RST  (via drill 0.51)
  Top 0.254: U4.57 22.1,22.61 20.83,22.61 20.45,22.99 20.45,29.46 | v25.4,33.27 33.27,33.27 34.29,34.29 JP1.2 | S3.3 S3.4 19.05,32.38 | 19.05,32.38 19.18,32.38 19.43,32.13 v19.43,30.48 20.19,29.72 20.45,29.46 | R1.1 20.32,34.29 19.05,33.02 19.05,32.38 | 20.57,29.34 20.45,29.46
  Bottom 0.254: v25.4,33.27 20.57,33.27 19.43,32.13 v19.43,30.48
RXI-0  (via drill 0.51)
  Top 0.254: U4.21 32.61,21.11 v32,21.72 | v33.02,34.29 31.75,34.29 JP1.4
  Bottom 0.254: v32,21.72 32,21.84 33.02,22.86 v33.02,34.29
RXI-1  (via drill 0.51)
  Top 0.254: U4.34 31.19,30.05 31.5,30.35 40.51,30.35 v40.64,30.48
  Bottom 0.254: v40.64,30.48 52.07,30.48 53.34,29.21 53.34,6.35 54.61,5.08 JP5.6
SCK0  (via drill 0.51)
  Top 0.254: U4.27 35.96,24.11 v36.58,23.5 | J1.SCLK 51.34,22.32 v50.8,22.86
  Bottom 0.254: v36.58,23.5 50.16,23.5 v50.8,22.86
SCK1  (via drill 0.51)
  Top 0.254: U4.47 24.69,26.87 v24.89,26.67
  Bottom 0.254: JP4.4 10.16,5.08 12.7,5.08 13.97,6.35 13.97,16.51 24.13,26.67 v24.89,26.67
STAT
  Top 0.254: Q4.3 45.72,12.57 45.85,12.7 45.85,13.46 46.35,13.97 LED3.A R11.1
STAT0
  Top 0.254: U4.22 34.52,21.61 35.05,21.08 35.05,20.19 38.73,16.51 45.72,16.51 47.62,18.41 53.09,18.41 53.72,17.78 55.88,17.78 56.52,18.41 56.52,22.23 58.42,24.13 58.42,27.94 55.88,30.48 50.8,30.48 48.77,32.51 48.77,34.17 LED2.C
STAT1
  Top 0.254: U4.37 29.69,30.32 30.23,30.86 38.48,30.86 40.64,33.02 43.43,33.02 43.94,33.53 43.94,34.17 LED4.C
STOP  (via drill 0.51)
  Top 0.254: U4.26 32.12,23.61 v31.62,23.11 | v32.13,15.11 31.75,14.73 31.75,11.43 33.02,10.16 S2.3 33.02,8.26 33.66,7.62 39.37,7.62 | 39.37,7.62 C1.1 R6.1 | JP6.1 39.37,7.62
  Bottom 0.254: v31.62,23.11 30.99,22.48 30.99,20.83 32.13,19.68 v32.13,15.11
TXO-0  (via drill 0.51)
  Top 0.254: U4.19 32.34,20.11 30.73,21.72 30.73,24 v31.37,24.64
  Bottom 0.254: JP1.3 31.75,25.02 v31.37,24.64
TXO-1  (via drill 0.51)
  Top 0.254: U4.33 31.69,29.53 31.88,29.72 37.59,29.72 v38.1,29.21
  Bottom 0.254: v38.1,29.21 50.8,29.21 52.07,27.94 JP5.5
USB_D+
  Top 0.254: 50.23,13.97 50.18,13.92 50.13,13.97 R11.2 R9.2 52.07,13.76 52.07,13.34 52.7,12.7 54.61,12.7 56.01,11.3 X1.D+1
USB_D-
  Top 0.254: X1.D-1 55.39,10.65 54.61,11.43 R10.2
USB_VIN  (via drill 0.51)
  Top 0.254: v27.94,6.35 12.7,6.35 v11.43,7.62 | v10.16,29.21 11.43,29.21 | 11.43,29.21 C17.1 | U1.4 11.4,29.18 11.43,29.21 | R3.2 16.76,25.4 16,24.64 v14.86,24.64 | C2.1 R14.2 R8.2 | R8.2 51.22,7.2 | 55.12,7.33 C2.1 | X1.VBUS1 55.85,10 55.24,9.4 C2.1 | R8.2 51.4,7.24 51.4,8.17 51.05,8.51 v50.29,8.51
  Bottom 0.254: 44.45,3.81 31.11,3.81 28.57,6.35 v27.94,6.35 | 44.45,3.81 48.26,3.81 50.29,5.84 v50.29,8.51 | 44.45,3.81 JP5.2 | v11.43,7.62 11.43,24.64 | 11.43,24.64 v14.86,24.64 | 11.43,24.64 11.43,27.94 v10.16,29.21
VCC  (via drill 0.51)  (3 unrouted)
  Top 0.254: 24.75,31.73 24.77,31.75 R7.1 | 24.77,29.59 23.5,29.59 22.35,28.45 22.35,26.67 22.34,26.66 U4.49 23.3,26.61 23.5,26.42 23.5,25.78 23.32,25.61 U4.51 | 24.77,29.59 26.54,29.59 26.69,29.44 U4.43 26.69,27.45 26.29,27.05 26.29,25.91 v29.21,22.99 | U4.23 34.79,22.11 35.31,21.59 C10.1 35.98,20.66 v36.32,20.32 | v48.13,8.89 R13.2 46.67,8.99 Q4.2 | C8.1 26.67,14.61 27.19,15.12 U4.7 27.19,19.16 | 24.13,34.92 JP1.6 | 27.19,19.16 27.3,19.05 v30.48,19.05 31.37,19.05 33.59,16.83 v33.59,15.24 37.34,11.49 41.21,11.49 41.91,10.79 41.91,10.38 R6.2 42.29,9.99 v42.29,8.89 | 27.19,19.16 26.54,19.81 24.13,19.81 23.93,19.61 U4.63 20.88,19.61 20.32,19.05 20.32,16.51 19.05,15.24 17.78,15.24 16.93,14.39 C12.1 14.95,13.97 U2.5 13.65,11.75 14.1,11.3 C6.A | JP5.3 46.99,3.81 v45.72,5.08 | 46.99,35.56 R4.1 | 46.99,35.56 46.99,31.75 49.53,29.21 55.88,29.21 57.15,27.94 57.15,24.13 56.44,23.42 J1.VCC 51.51,23.42 v50.8,24.13 43.81,24.13 43.18,23.5 42.12,23.5 C11.1 | 46.99,35.56 R5.1 | 23.91,35.14 24.13,34.92 | R7.1 C9.1 24.55,29.81 24.77,29.59 | 24.13,34.92 24.13,34.29 | 24.13,34.29 24.13,33.02 24.77,32.38 24.77,31.96 R7.1 | C7.1 R7.1 | R1.2 24.13,34.29
  Bottom 0.254: v33.59,15.24 33.59,20.32 | v42.29,8.89 45.72,8.89 | 45.72,8.89 v48.13,8.89 | 33.59,20.32 v36.32,20.32 | 33.59,20.32 33.59,23.18 34.8,24.38 50.55,24.38 v50.8,24.13 | v30.48,19.05 30.48,21.72 v29.21,22.99 | 45.72,8.89 v45.72,5.08
VLIPO
  Top 0.254: S1.2 7.87,13.97 6.35,15.49 6.35,17.78 10.41,21.84 10.41,22.1 | U1.3 13.4,27.62 12.45,26.67 10.54,26.67 10.41,26.54 10.41,26.42 | 10.41,22.1 10.41,26.42 | JP2.2 10.4,26.4 10.41,26.42 | C5.1 10.54,22.23 10.41,22.1

### Text on the board
Bottom: v27
tPlace: 3.3V | GND | RXI0 | TXO0 | RST | BSL | STAT1 | STAT0 | RESET | CHARGE | + | - | ON | USB | OFF | STOP | Logomatic | Digital/Analog | SCK | MISO | MOSI | CS | GND | 8 | 7 | 6 | 5 | 4 | 3 | 2 | 1 | STOP | BATT | USB | 3.3V | GND | TXO1 | RXI1
tValues: Horizontal JST
tDocu: C. Taylor and N. Seidle | Toni Klopfenstein